# EAGLE design StrErfassungMainBoardFinalWide (EAGLE 9.6.2)
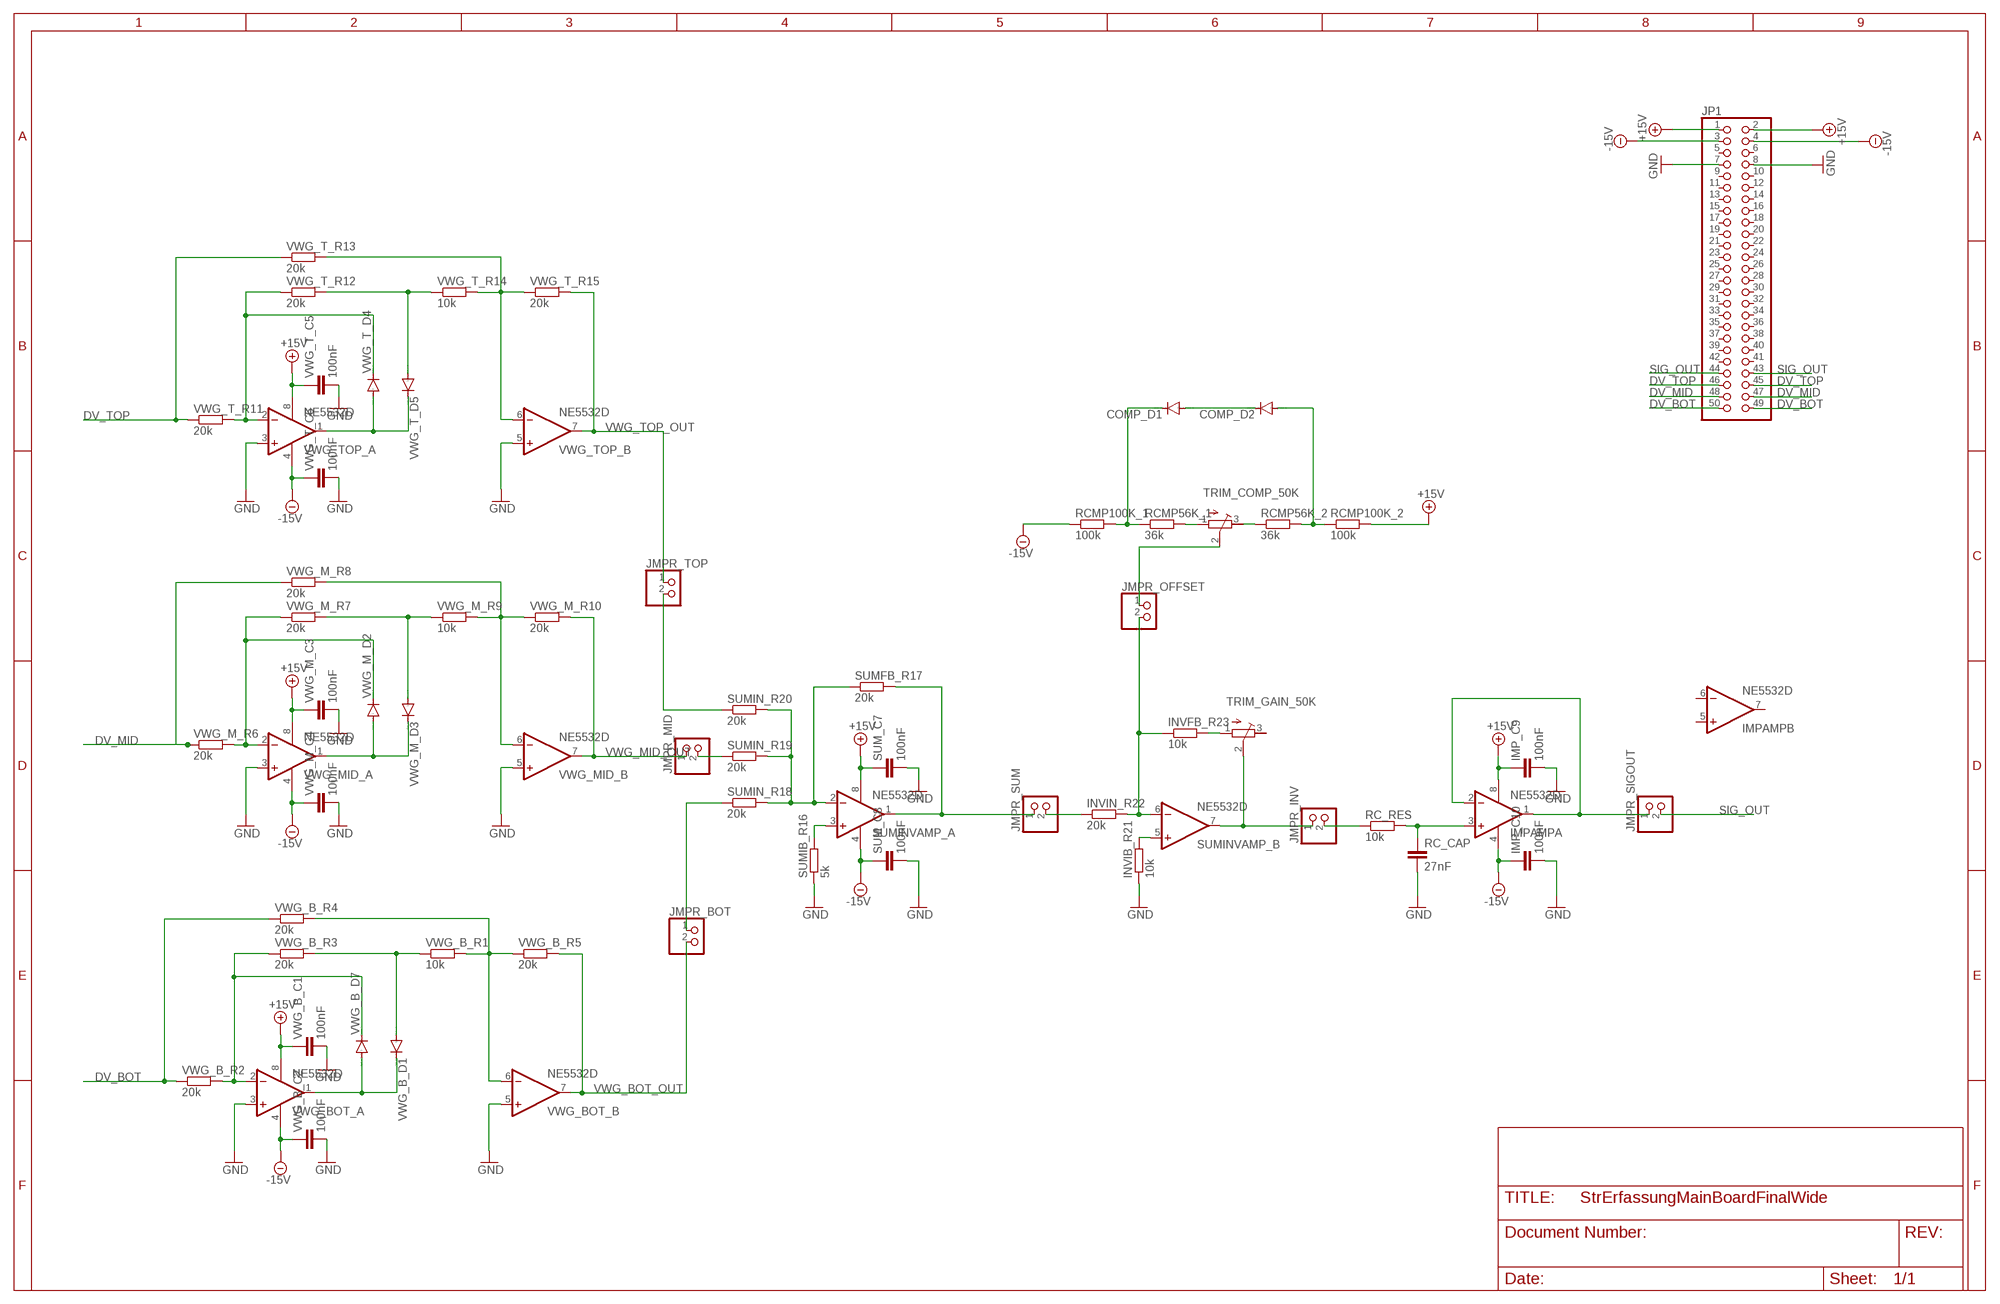
[diagram p0: schematic, sheet 1]

## Parts
COMP_D1  DIODE-SOD123  [SOD123]
COMP_D2  DIODE-SOD123  [SOD123]
IMP_C9  100nF  C-EUC0805  [C0805]
IMP_C10  100nF  C-EUC0805  [C0805]
IMPAMP  NE5532D  [SO08]
INVFB_R23  10k  R-EU_R0805  [R0805]
INVIB_R21  10k  R-EU_R0805  [R0805]
INVIN_R22  20k  R-EU_R0805  [R0805]
JMPR_BOT  PINHD-1X2  [1X02]
JMPR_INV  PINHD-1X2  [1X02]
JMPR_MID  PINHD-1X2  [1X02]
JMPR_OFFSET  PINHD-1X2  [1X02]
JMPR_SIGOUT  PINHD-1X2  [1X02]
JMPR_SUM  PINHD-1X2  [1X02]
JMPR_TOP  PINHD-1X2  [1X02]
JP1  PINHD-2X25/90  [2X25/90]
RC_CAP  27nF  C-EUC0805  [C0805]
RC_RES  10k  R-EU_R0805  [R0805]
RCMP56K_1  36k  R-EU_R0805  [R0805]
RCMP56K_2  36k  R-EU_R0805  [R0805]
RCMP100K_1  100k  R-EU_R0805  [R0805]
RCMP100K_2  100k  R-EU_R0805  [R0805]
SUM_C7  100nF  C-EUC0805  [C0805]
SUM_C8  100nF  C-EUC0805  [C0805]
SUMFB_R17  20k  R-EU_R0805  [R0805]
SUMIB_R16  5k  R-EU_R0805  [R0805]
SUMIN_R18  20k  R-EU_R0805  [R0805]
SUMIN_R19  20k  R-EU_R0805  [R0805]
SUMIN_R20  20k  R-EU_R0805  [R0805]
SUMINVAMP_  NE5532D  [SO08]
TRIM_COMP_50K  R-TRIMM3296W  [RTRIM3296W]
TRIM_GAIN_50K  R-TRIMM3296W  [RTRIM3296W]
VWG_B_C1  100nF  C-EUC0805  [C0805]
VWG_B_C2  100nF  C-EUC0805  [C0805]
VWG_B_D1  DIODE-SOD123  [SOD123]
VWG_B_D7  DIODE-SOD123  [SOD123]
VWG_B_R1  10k  R-EU_R0805  [R0805]
VWG_B_R2  20k  R-EU_R0805  [R0805]
VWG_B_R3  20k  R-EU_R0805  [R0805]
VWG_B_R4  20k  R-EU_R0805  [R0805]
VWG_B_R5  20k  R-EU_R0805  [R0805]
VWG_BOT_  NE5532D  [SO08]
VWG_M_C3  100nF  C-EUC0805  [C0805]
VWG_M_C4  100nF  C-EUC0805  [C0805]
VWG_M_D2  DIODE-SOD123  [SOD123]
VWG_M_D3  DIODE-SOD123  [SOD123]
VWG_M_R6  20k  R-EU_R0805  [R0805]
VWG_M_R7  20k  R-EU_R0805  [R0805]
VWG_M_R8  20k  R-EU_R0805  [R0805]
VWG_M_R9  10k  R-EU_R0805  [R0805]
VWG_M_R10  20k  R-EU_R0805  [R0805]
VWG_MID_  NE5532D  [SO08]
VWG_T_C5  100nF  C-EUC0805  [C0805]
VWG_T_C6  100nF  C-EUC0805  [C0805]
VWG_T_D4  DIODE-SOD123  [SOD123]
VWG_T_D5  DIODE-SOD123  [SOD123]
VWG_T_R11  20k  R-EU_R0805  [R0805]
VWG_T_R12  20k  R-EU_R0805  [R0805]
VWG_T_R13  20k  R-EU_R0805  [R0805]
VWG_T_R14  10k  R-EU_R0805  [R0805]
VWG_T_R15  20k  R-EU_R0805  [R0805]
VWG_TOP_  NE5532D  [SO08]

## Nets
+15V: IMP_C9.1 IMPAMP.8(P:V+) JP1.1 JP1.2 RCMP100K_2.2 SUM_C7.1 SUMINVAMP_.8(P:V+) VWG_B_C1.1 VWG_BOT_.8(P:V+) VWG_M_C3.1 VWG_MID_.8(P:V+) VWG_T_C5.1 VWG_TOP_.8(P:V+)
-15V: IMP_C10.1 IMPAMP.4(P:V-) JP1.3 JP1.4 RCMP100K_1.1 SUM_C8.1 SUMINVAMP_.4(P:V-) VWG_B_C2.1 VWG_BOT_.4(P:V-) VWG_M_C4.1 VWG_MID_.4(P:V-) VWG_T_C6.1 VWG_TOP_.4(P:V-)
DV_BOT: JP1.49 JP1.50 VWG_B_R2.1 VWG_B_R4.1
DV_MID: JP1.47 JP1.48 VWG_M_R6.1 VWG_M_R8.1
DV_TOP: JP1.45 JP1.46 VWG_T_R11.1 VWG_T_R13.1
GND: IMP_C9.2 IMP_C10.2 INVIB_R21.1 JP1.7 JP1.8 RC_CAP.2 SUM_C7.2 SUM_C8.2 SUMIB_R16.1 VWG_B_C1.2 VWG_B_C2.2 VWG_BOT_.3(A:+IN) VWG_BOT_.5(B:+IN) VWG_M_C3.2 VWG_M_C4.2 VWG_MID_.3(A:+IN) VWG_MID_.5(B:+IN) VWG_T_C5.2 VWG_T_C6.2 VWG_TOP_.3(A:+IN) VWG_TOP_.5(B:+IN)
JMPR_INV: JMPR_INV.1 SUMINVAMP_.7(B:OUT) TRIM_GAIN_50K.2(S)
N$2: VWG_B_D1.A VWG_B_R1.1 VWG_B_R3.2
N$3: VWG_B_D1.C VWG_B_D7.A VWG_BOT_.1(A:OUT)
N$4: VWG_M_D2.C VWG_M_R6.2 VWG_M_R7.1 VWG_MID_.2(A:-IN)
N$5: VWG_M_D3.A VWG_M_R7.2 VWG_M_R9.1
N$6: VWG_B_R1.2 VWG_B_R4.2 VWG_B_R5.1 VWG_BOT_.6(B:-IN)
N$7: VWG_M_D2.A VWG_M_D3.C VWG_MID_.1(A:OUT)
N$8: SUMFB_R17.1 SUMIN_R18.2 SUMIN_R19.2 SUMIN_R20.2 SUMINVAMP_.2(A:-IN)
N$9: VWG_M_R8.2 VWG_M_R9.2 VWG_M_R10.1 VWG_MID_.6(B:-IN)
N$10: INVIB_R21.2 SUMINVAMP_.5(B:+IN)
N$11: VWG_T_D4.C VWG_T_R11.2 VWG_T_R12.1 VWG_TOP_.2(A:-IN)
N$12: VWG_T_D5.A VWG_T_R12.2 VWG_T_R14.1
N$13: VWG_T_D4.A VWG_T_D5.C VWG_TOP_.1(A:OUT)
N$14: VWG_T_R13.2 VWG_T_R14.2 VWG_T_R15.1 VWG_TOP_.6(B:-IN)
N$15: INVFB_R23.1 INVIN_R22.2 JMPR_OFFSET.2 SUMINVAMP_.6(B:-IN)
N$16: SUMIB_R16.2 SUMINVAMP_.3(A:+IN)
N$17: JMPR_OFFSET.1 TRIM_COMP_50K.2(S)
N$18: JMPR_SUM.1 SUMFB_R17.2 SUMINVAMP_.1(A:OUT)
N$19: IMPAMP.3(A:+IN) RC_CAP.1 RC_RES.2
N$20: RCMP56K_2.1 TRIM_COMP_50K.3(E)
N$21: COMP_D2.A RCMP56K_2.2 RCMP100K_2.1
N$22: COMP_D1.C RCMP56K_1.1 RCMP100K_1.2
N$23: RCMP56K_1.2 TRIM_COMP_50K.1(A)
N$24: COMP_D1.A COMP_D2.C
N$25: INVFB_R23.2 TRIM_GAIN_50K.1(A)
N$26: INVIN_R22.1 JMPR_SUM.2
N$27: JMPR_BOT.1 SUMIN_R18.1
N$28: JMPR_TOP.2 SUMIN_R20.1
N$29: JMPR_MID.2 SUMIN_R19.1
N$30: JMPR_INV.2 RC_RES.1
SIG_OUT: IMPAMP.1(A:OUT) IMPAMP.2(A:-IN) JMPR_SIGOUT.1 JMPR_SIGOUT.2 JP1.43 JP1.44
VWG_BOT_OUT: JMPR_BOT.2 VWG_B_R5.2 VWG_BOT_.7(B:OUT)
VWG_IN-: VWG_B_D7.C VWG_B_R2.2 VWG_B_R3.1 VWG_BOT_.2(A:-IN)
VWG_MID_OUT: JMPR_MID.1 VWG_M_R10.2 VWG_MID_.7(B:OUT)
VWG_TOP_OUT: JMPR_TOP.1 VWG_T_R15.2 VWG_TOP_.7(B:OUT)
Unconnected: IMPAMP.5(B:+IN) IMPAMP.6(B:-IN) IMPAMP.7(B:OUT) JP1.5 JP1.6 JP1.9 JP1.10 JP1.11 JP1.12 JP1.13 JP1.14 JP1.15 JP1.16 JP1.17 JP1.18 JP1.19 JP1.20 JP1.21 JP1.22 JP1.23 JP1.24 JP1.25 JP1.26 JP1.27 JP1.28 JP1.29 JP1.30 JP1.31 JP1.32 JP1.33 JP1.34 JP1.35 JP1.36 JP1.37 JP1.38 JP1.39 JP1.40 JP1.41 JP1.42 TRIM_GAIN_50K.3(E)

## Library data of the parts
COMP_D1 COMP_D2 VWG_B_D1 VWG_B_D7 VWG_M_D2 VWG_M_D3 VWG_T_D4 VWG_T_D5 = diode:DIODE-: DIODE
IMP_C9 IMP_C10 RC_CAP SUM_C7 SUM_C8 VWG_B_C1 VWG_B_C2 VWG_M_C3 VWG_M_C4 VWG_T_C5 VWG_T_C6 = rcl:C-EU: CAPACITOR, European symbol; SPICEPREFIX: C
IMPAMP SUMINVAMP_ VWG_BOT_ VWG_MID_ VWG_TOP_ = linear:NE5532: AUDIO AMPLIFIER
INVFB_R23 INVIB_R21 INVIN_R22 RC_RES RCMP56K_1 RCMP56K_2 RCMP100K_1 RCMP100K_2 SUMFB_R17 SUMIB_R16 SUMIN_R18-SUMIN_R20 VWG_B_R1-VWG_B_R5 VWG_M_R6-VWG_M_R10 VWG_T_R11-VWG_T_R15 = rcl:R-EU_: RESISTOR, European symbol; SPICEPREFIX: R
JMPR_BOT JMPR_INV JMPR_MID JMPR_OFFSET JMPR_SIGOUT JMPR_SUM JMPR_TOP = pinhead:PINHD-1X2: PIN HEADER
JP1 = pinhead:PINHD-2X25: PIN HEADER
TRIM_COMP_50K TRIM_GAIN_50K = rcl:R-TRIMM: Trimm resistor; SPICEMODEL: X; SPICEPREFIXL: POT

## Net classes
0 default: width 0.609 mm, drill 0.8 mm, clearance 0.305 mm

## Board
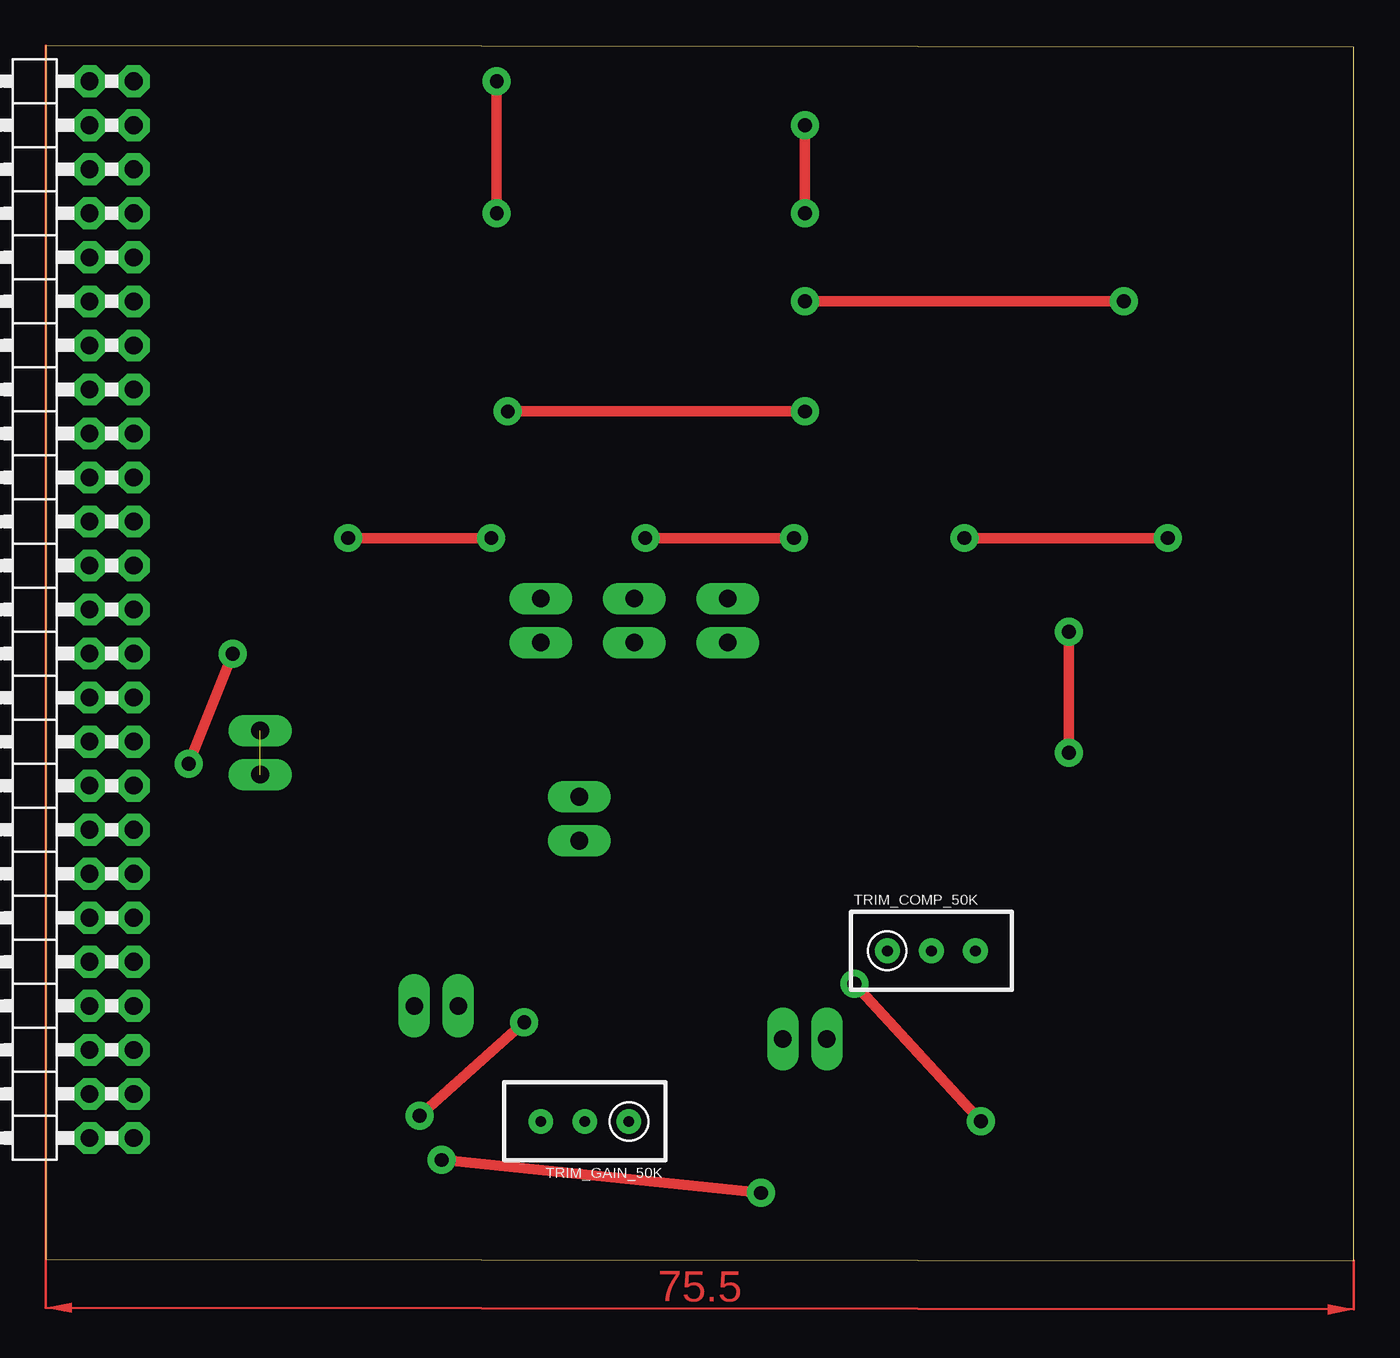
[diagram p1: board, top side]
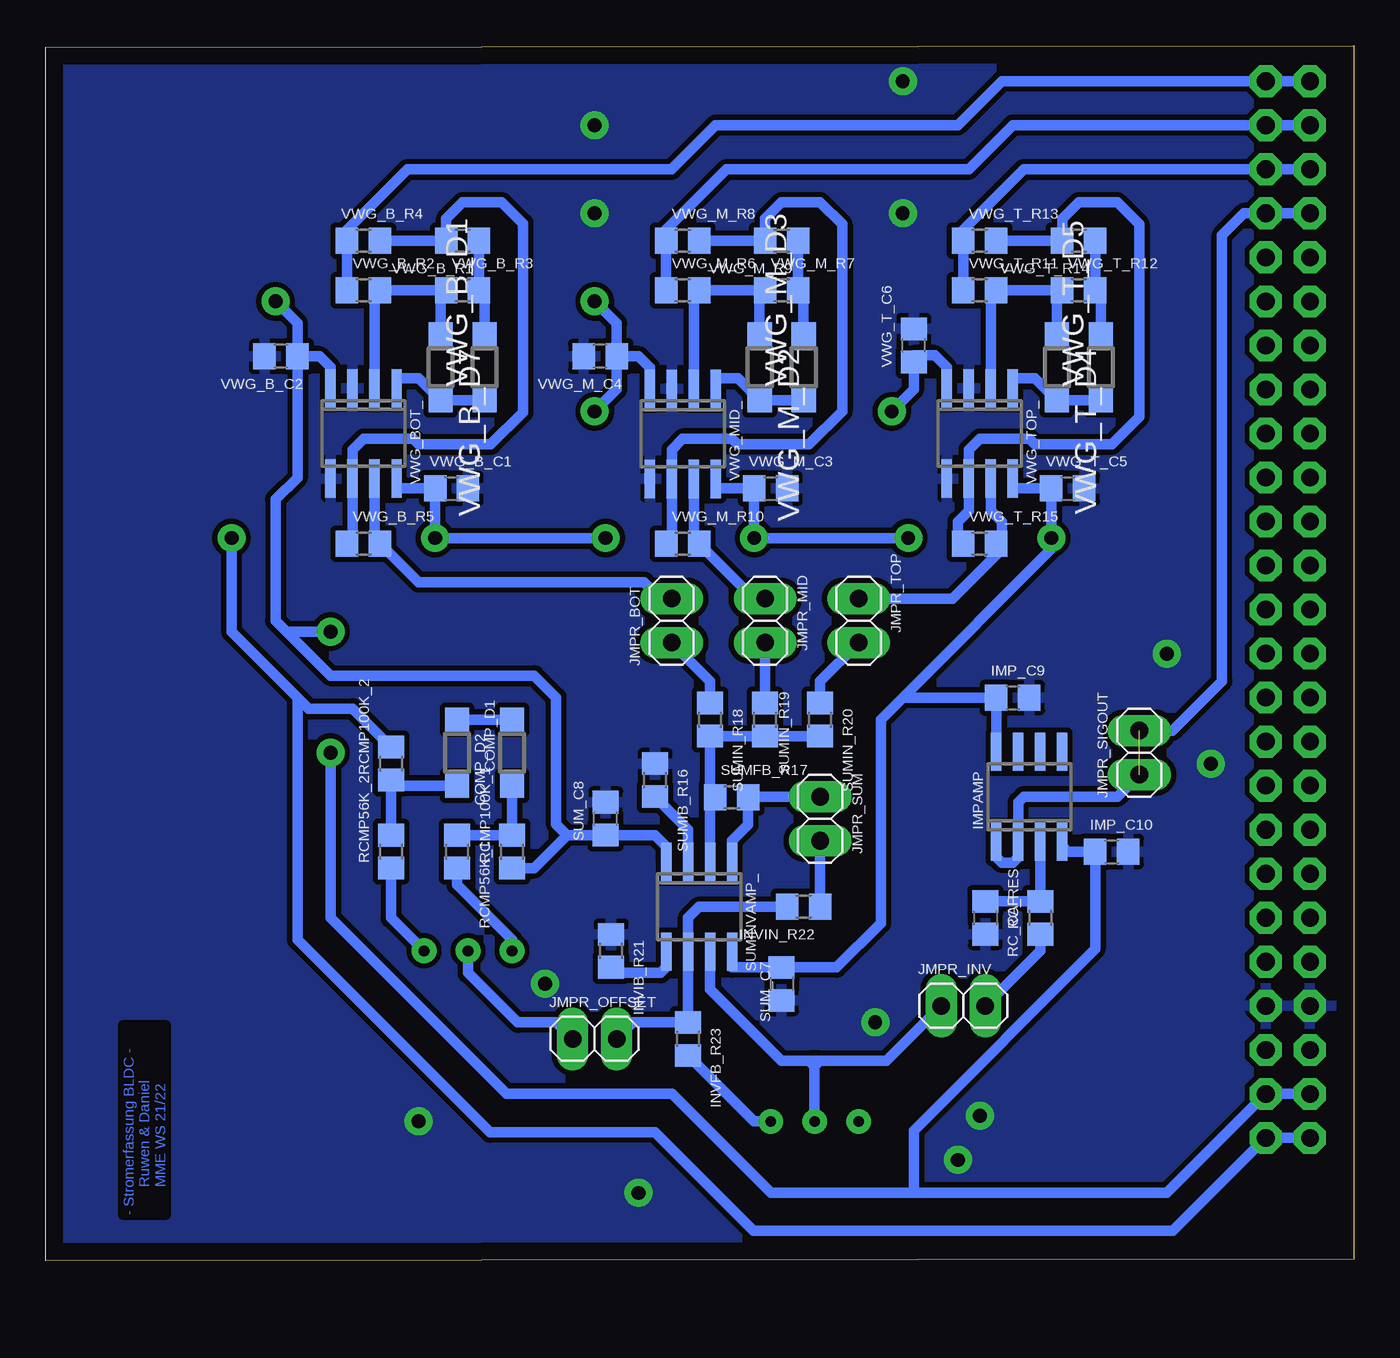
[diagram p2: board, bottom side, seen from below]

Size 75.5 x 70.1 mm. Coordinates in mm from the lower left corner, seen from the top.
Outline: 0,0.1 75.5,0 75.5,70 0,70.1 0,0.1
Copper layers (1*16): Top 0.035mm / dielectric 1.5mm / Bottom 0.035mm
Design rules "default *": minimum track width 6mil, minimum drill 0.35mm, track to track 6mil, track to pad 6mil, pad to pad 6mil, via to via 6mil, smd to smd 6mil, copper to edge 40mil, drill to drill 6mil, minimum pad ring 16mil, minimum via ring 16mil, stop-mask expansion 4mil, vias tented up to drill 0mil, thermal gap 10mil

### Footprints (pad centres in the part's own frame; a part is rotated, then mirrored left to right if it is on the bottom)
SOD123 = smd 1.4 x 1.4: A 1.9,0; C -1.9,0
C0805 = smd 1.3 x 1.5: 1 -0.95,0; 2 0.95,0
SO08 = smd 0.6 x 2.2: 1 -1.905,-2.6; 2 -0.635,-2.6; 3 0.635,-2.6; 4 1.905,-2.6; 5 1.905,2.6; 6 0.635,2.6; 7 -0.635,2.6; 8 -1.905,2.6
R0805 = smd 1.3 x 1.5: 1 -0.95,0; 2 0.95,0
1X02 = drill 1.016 long: 1 -1.27,0; 2 1.27,0
2X25/90 = drill 1.016 octagon: 1 -29.21,-6.35; 2 -29.21,-3.81; 3 -26.67,-6.35; 4 -26.67,-3.81; 5 -24.13,-6.35; 6 -24.13,-3.81; 7 -21.59,-6.35; 8 -21.59,-3.81; 9 -19.05,-6.35; 10 -19.05,-3.81; 11 -16.51,-6.35; 12 -16.51,-3.81; 13 -13.97,-6.35; 14 -13.97,-3.81; 15 -11.43,-6.35; 16 -11.43,-3.81; 17 -8.89,-6.35; 18 -8.89,-3.81; 19 -6.35,-6.35; 20 -6.35,-3.81; 21 -3.81,-6.35; 22 -3.81,-3.81; 23 -1.27,-6.35; 24 -1.27,-3.81; 25 1.27,-6.35; 26 1.27,-3.81; 27 3.81,-6.35; 28 3.81,-3.81; 29 6.35,-6.35; 30 6.35,-3.81; 31 8.89,-6.35; 32 8.89,-3.81; 33 11.43,-6.35; 34 11.43,-3.81; 35 13.97,-6.35; 36 13.97,-3.81; 37 16.51,-6.35; 38 16.51,-3.81; 39 19.05,-6.35; 40 19.05,-3.81; 41 21.59,-6.35; 42 21.59,-3.81; 43 24.13,-6.35; 44 24.13,-3.81; 45 26.67,-6.35; 46 26.67,-3.81; 47 29.21,-6.35; 48 29.21,-3.81; 49 31.75,-6.35; 50 31.75,-3.81
RTRIM3296W = drill 0.61: 1 0,-2.54; 2 0,0; 3 0,2.54

### Placement (x,y rotation side)
COMP_D1  48.58,29.31 90 bottom
COMP_D2  51.75,29.31 270 bottom
IMP_C9  19.68,32.48 0 bottom
IMP_C10  13.97,23.6 0 bottom
IMPAMP  18.73,26.77 0 bottom
INVFB_R23  38.42,12.8 270 bottom
INVIB_R21  42.86,17.88 270 bottom
INVIN_R22  31.75,20.42 180 bottom
JMPR_BOT  39.37,36.93 90 bottom
JMPR_INV  22.54,14.71 0 bottom
JMPR_MID  33.97,36.93 270 bottom
JMPR_OFFSET  43.81,12.8 0 bottom
JMPR_SIGOUT  12.38,29.31 90 bottom
JMPR_SUM  30.8,25.5 270 bottom
JMPR_TOP  28.57,36.93 270 bottom
JP1  -1.27,36.3 90 top
RC_CAP  21.27,19.79 270 bottom
RC_RES  18.1,19.79 90 bottom
RCMP56K_1  51.75,23.6 270 bottom
RCMP56K_2  55.56,23.6 90 bottom
RCMP100K_1  48.58,23.6 90 bottom
RCMP100K_2  55.56,28.68 90 bottom
SUM_C7  33.02,15.97 270 bottom
SUM_C8  43.18,25.5 90 bottom
SUMFB_R17  35.9,26.75 0 bottom
SUMIB_R16  40.32,27.72 270 bottom
SUMIN_R18  37.15,31.21 270 bottom
SUMIN_R19  33.97,31.21 270 bottom
SUMIN_R20  30.8,31.21 270 bottom
SUMINVAMP_  37.78,20.42 180 bottom
TRIM_COMP_50K  51.12,17.88 270 top
TRIM_GAIN_50K  31.11,8.04 90 top
VWG_B_C1  52.07,44.55 0 bottom
VWG_B_C2  61.91,52.17 180 bottom
VWG_B_D1  50.16,51.54 90 bottom
VWG_B_D7  52.7,51.54 270 bottom
VWG_B_R1  51.44,58.84 180 bottom
VWG_B_R2  57.15,55.98 0 bottom
VWG_B_R3  51.44,55.98 0 bottom
VWG_B_R4  57.15,58.84 0 bottom
VWG_B_R5  57.15,41.38 0 bottom
VWG_BOT_  57.15,47.73 180 bottom
VWG_M_C3  33.66,44.55 0 bottom
VWG_M_C4  43.5,52.17 180 bottom
VWG_M_D2  34.29,51.54 270 bottom
VWG_M_D3  31.75,51.54 90 bottom
VWG_M_R6  38.73,55.98 0 bottom
VWG_M_R7  33.02,55.98 0 bottom
VWG_M_R8  38.73,58.84 0 bottom
VWG_M_R9  33.02,58.84 180 bottom
VWG_M_R10  38.73,41.38 0 bottom
VWG_MID_  38.73,47.7 180 bottom
VWG_T_C5  16.51,44.55 0 bottom
VWG_T_C6  25.4,52.8 90 bottom
VWG_T_D4  17.14,51.54 270 bottom
VWG_T_D5  14.61,51.54 90 bottom
VWG_T_R11  21.59,55.98 0 bottom
VWG_T_R12  15.88,55.98 0 bottom
VWG_T_R13  21.59,58.84 0 bottom
VWG_T_R14  15.88,58.84 180 bottom
VWG_T_R15  21.59,41.38 0 bottom
VWG_TOP_  21.59,47.73 180 bottom

### Tracks (layer width: path | path; a pad name or v marks a point on that pad's centre or on a via)
+15V  (via drill 0.8)
  Top 0.609: v17.46,41.69 v25.72,41.69 | v34.61,41.69 v43.18,41.69 | v64.77,41.69 v53.02,41.69
  Bottom 0.609: JP1.2 JP1.1 10.44,1.73 34.65,1.73 40.32,7.4 49.85,7.4 60.96,18.52 60.96,32.48 | SUMINVAMP_.8 35.88,16.93 SUM_C7.1 29.85,16.93 27.3,19.47 27.3,31.21 26.04,32.48 | VWG_BOT_.8 55.24,44.55 VWG_B_C1.1 v53.02,41.7 v53.02,41.69 v43.18,41.69 | VWG_MID_.8 36.83,44.55 VWG_M_C3.1 v34.6,41.7 v34.61,41.69 v25.72,41.69 | VWG_TOP_.8 19.68,44.55 VWG_T_C5.1 v17.46,41.7 | v17.46,41.7 v17.46,41.69 | v64.77,41.69 64.77,36.3 60.96,32.48 | 60.96,32.48 60.33,31.85 57.79,31.85 RCMP100K_2.2 | 26.04,32.48 17.46,41.06 v17.46,41.7 | IMPAMP.8 IMP_C9.1 26.04,32.48
-15V  (via drill 0.8)
  Top 0.609: v59.05,36.3 v59.05,29.31 | v26.67,49 v43.81,49 | v43.81,55.34 v62.23,55.34
  Bottom 0.609: SUMINVAMP_.4 39.69,23.91 40.32,24.55 42.54,24.55 SUM_C8.1 45.4,24.55 | JP1.4 JP1.3 10.79,3.91 25.4,3.91 | VWG_TOP_.4 23.5,51.54 24.19,52.23 25.4,52.23 VWG_T_C6.1 25.4,50.27 v26.67,49 | IMPAMP.4 16.83,23.91 16.51,23.6 IMP_C10.1 14.92,17.99 25.4,7.51 25.4,3.91 | RCMP100K_1.1 47.3,22.65 45.4,24.55 | 45.4,24.55 46.04,25.19 46.04,32.48 47.31,33.76 59.05,33.76 61.59,36.3 | VWG_M_C4.1 42.55,54.08 v43.81,55.34 | VWG_M_C4.1 42.55,50.26 v43.81,49 | VWG_BOT_.4 59.05,51.54 59.69,52.17 VWG_B_C2.1 | VWG_MID_.4 40.63,51.53 41.27,52.17 VWG_M_C4.1 | VWG_B_C2.1 60.96,54.08 v62.23,55.34 | 25.4,3.91 33.63,3.91 39.35,9.62 48.9,9.62 59.05,19.79 v59.05,29.31 | VWG_B_C2.1 60.96,45.18 62.23,43.91 62.23,36.93 61.59,36.3 | v59.05,36.3 61.59,36.3
DV_BOT
  Bottom 0.609: VWG_B_R2.1 VWG_B_R4.1 58.1,59.48 54.61,62.97 39.37,62.97 36.83,65.5 22.86,65.5 20.32,68.04 JP1.49 JP1.50
DV_MID
  Bottom 0.609: VWG_M_R6.1 VWG_M_R8.1 39.69,59.48 36.2,62.97 22.23,62.97 19.68,65.5 JP1.47 JP1.48
DV_TOP
  Bottom 0.609: VWG_T_R11.1 VWG_T_R13.1 22.54,59.48 19.05,62.97 JP1.45 JP1.46
GND  (via drill 0.8)
  Top 0.609: v10.79,35.02 v8.26,28.68 | v26.04,68.04 v26.04,60.43 | v43.81,65.5 v43.81,60.43 | v21.59,8.36 v27.62,13.75 | v46.67,15.97 v53.98,8.04 | v22.86,5.81 v41.27,3.91
  pour Bottom: 0,69.95 0,0.1 75.56,0.1 75.56,69.95
JMPR_INV
  Bottom 0.609: 31.43,11.53 31.11,11.21 | TRIM_GAIN_50K.2 31.11,11.21 | JMPR_INV.1 26.99,11.53 30.8,11.53 | 31.11,11.21 30.8,11.53 | 30.8,11.53 31.43,11.53 | 31.43,11.53 33.02,11.53 37.15,15.66 SUMINVAMP_.7
N$2
  Bottom 0.609: VWG_B_R1.1 VWG_B_R3.2 50.16,55.66 VWG_B_D1.A
N$3
  Bottom 0.609: VWG_B_D1.C VWG_B_D7.A 53.97,50.9 55.24,50.9 VWG_BOT_.1
N$4
  Bottom 0.609: VWG_MID_.2 38.09,55.67 VWG_M_R6.2 34.29,55.98 | VWG_M_R7.1 34.29,55.98 | VWG_M_D2.C 34.29,55.98
N$5
  Bottom 0.609: VWG_M_R9.1 VWG_M_R7.2 31.75,55.66 VWG_M_D3.A
N$6
  Bottom 0.609: VWG_B_R4.2 VWG_B_R1.2 52.38,60.11 51.44,61.06 49.18,61.06 47.94,59.83 47.94,48.96 49.81,47.09 53.98,47.09 54.29,47.41 57.15,47.41 57.78,46.77 VWG_BOT_.6 57.78,41.69 VWG_B_R5.1
N$7
  Bottom 0.609: VWG_M_D3.C VWG_M_D2.A 35.55,50.9 36.83,50.9 VWG_MID_.1
N$8
  Bottom 0.609: SUMIN_R20.2 SUMIN_R19.2 SUMIN_R18.2 37.15,27.04 SUMFB_R17.1 37.15,26.46 SUMINVAMP_.2
N$9
  Bottom 0.609: VWG_M_R8.2 VWG_M_R9.2 33.97,60.11 33.02,61.06 30.8,61.06 29.53,59.79 29.53,49 31.43,47.09 35.56,47.09 35.88,47.41 38.73,47.41 39.36,46.78 VWG_MID_.6 39.36,41.7 VWG_M_R10.1
N$10
  Bottom 0.609: SUMINVAMP_.5 39.69,16.93 40.01,16.61 42.54,16.61 INVIB_R21.2
N$11
  Bottom 0.609: VWG_TOP_.2 20.95,55.66 VWG_T_R11.2 17.14,55.98 | VWG_T_R12.1 17.14,55.98 | VWG_T_D4.C 17.14,55.98
N$12
  Bottom 0.609: VWG_T_R14.1 VWG_T_R12.2 14.61,55.66 VWG_T_D5.A
N$13
  Bottom 0.609: VWG_TOP_.1 19.68,50.9 18.41,50.9 VWG_T_D4.A VWG_T_D5.C
N$14
  Bottom 0.609: VWG_T_R15.1 22.86,41.7 22.86,42.65 22.23,43.28 VWG_TOP_.6 22.23,46.77 21.59,47.41 18.73,47.41 18.41,47.09 13.97,47.09 12.38,48.68 12.38,59.79 13.65,61.06 15.88,61.06 16.82,60.11 VWG_T_R14.2 VWG_T_R13.2
N$15
  Bottom 0.609: INVIN_R22.2 37.78,20.42 38.42,19.79 SUMINVAMP_.6 INVFB_R23.1 41.59,13.75 JMPR_OFFSET.2
N$16
  Bottom 0.609: SUMINVAMP_.3 38.42,24.87 SUMIB_R16.2
N$17
  Bottom 0.609: JMPR_OFFSET.1 46.04,13.75 48.26,13.75 51.12,16.61 TRIM_COMP_50K.2
N$18
  Bottom 0.609: SUMINVAMP_.1 35.88,24.23 34.95,25.15 SUMFB_R17.2 34.93,26.77 JMPR_SUM.1
N$19
  Bottom 0.609: IMPAMP.3 RC_RES.2 RC_CAP.1
N$20
  Bottom 0.609: RCMP56K_2.1 55.56,19.79 TRIM_COMP_50K.3
N$21
  Bottom 0.609: COMP_D2.A 55.25,27.41 RCMP100K_2.1 RCMP56K_2.2
N$22
  Bottom 0.609: COMP_D1.C RCMP100K_1.2 RCMP56K_1.1
N$23
  Bottom 0.609: RCMP56K_1.2 51.75,21.69 48.58,18.52 TRIM_COMP_50K.1
N$24
  Bottom 0.609: COMP_D1.A COMP_D2.C
N$25
  Bottom 0.609: INVFB_R23.2 34.6,8.04 TRIM_GAIN_50K.1
N$26
  Bottom 0.609: JMPR_SUM.2 INVIN_R22.1
N$27
  Bottom 0.609: SUMIN_R18.1 37.15,33.44 JMPR_BOT.1
N$28
  Bottom 0.609: JMPR_TOP.2 30.8,33.44 SUMIN_R20.1
N$29
  Bottom 0.609: JMPR_MID.2 SUMIN_R19.1
N$30
  Bottom 0.609: JMPR_INV.2 18.1,17.88 RC_RES.1
SIG_OUT  (1 unrouted)
  Bottom 0.609: JMPR_SIGOUT.1 13.65,26.77 19.05,26.77 19.37,26.45 IMPAMP.2 19.37,23.28 19.68,22.96 20.32,22.96 20.64,23.28 IMPAMP.1 | JMPR_SIGOUT.2 10.48,30.58 7.62,33.44 7.62,59.16 6.35,60.43 JP1.43 JP1.44
VWG_BOT_OUT
  Bottom 0.609: VWG_BOT_.7 56.52,41.69 VWG_B_R5.2 53.98,39.15 40.96,39.15 40.01,38.2 JMPR_BOT.2
VWG_IN-
  Bottom 0.609: 52.7,55.98 VWG_B_R2.2 56.52,55.66 VWG_BOT_.2 | 52.7,55.98 VWG_B_R3.1 | VWG_B_D7.C 52.7,55.98
VWG_MID_OUT
  Bottom 0.609: VWG_MID_.7 38.09,41.68 VWG_M_R10.2 34.61,38.2 JMPR_MID.1
VWG_TOP_OUT
  Bottom 0.609: VWG_TOP_.7 20.95,43.28 20.32,42.65 20.32,41.7 VWG_T_R15.2 20.64,40.74 23.18,38.2 JMPR_TOP.1
(copper drawn outside any net)
  shapes: Top area x2

### Text on the board
Bottom: - Stromerfassung BLDC - / Ruwen & Daniel / MME WS 21/22